# EAGLE design 6P1_EVB (EAGLE 7.5.0)
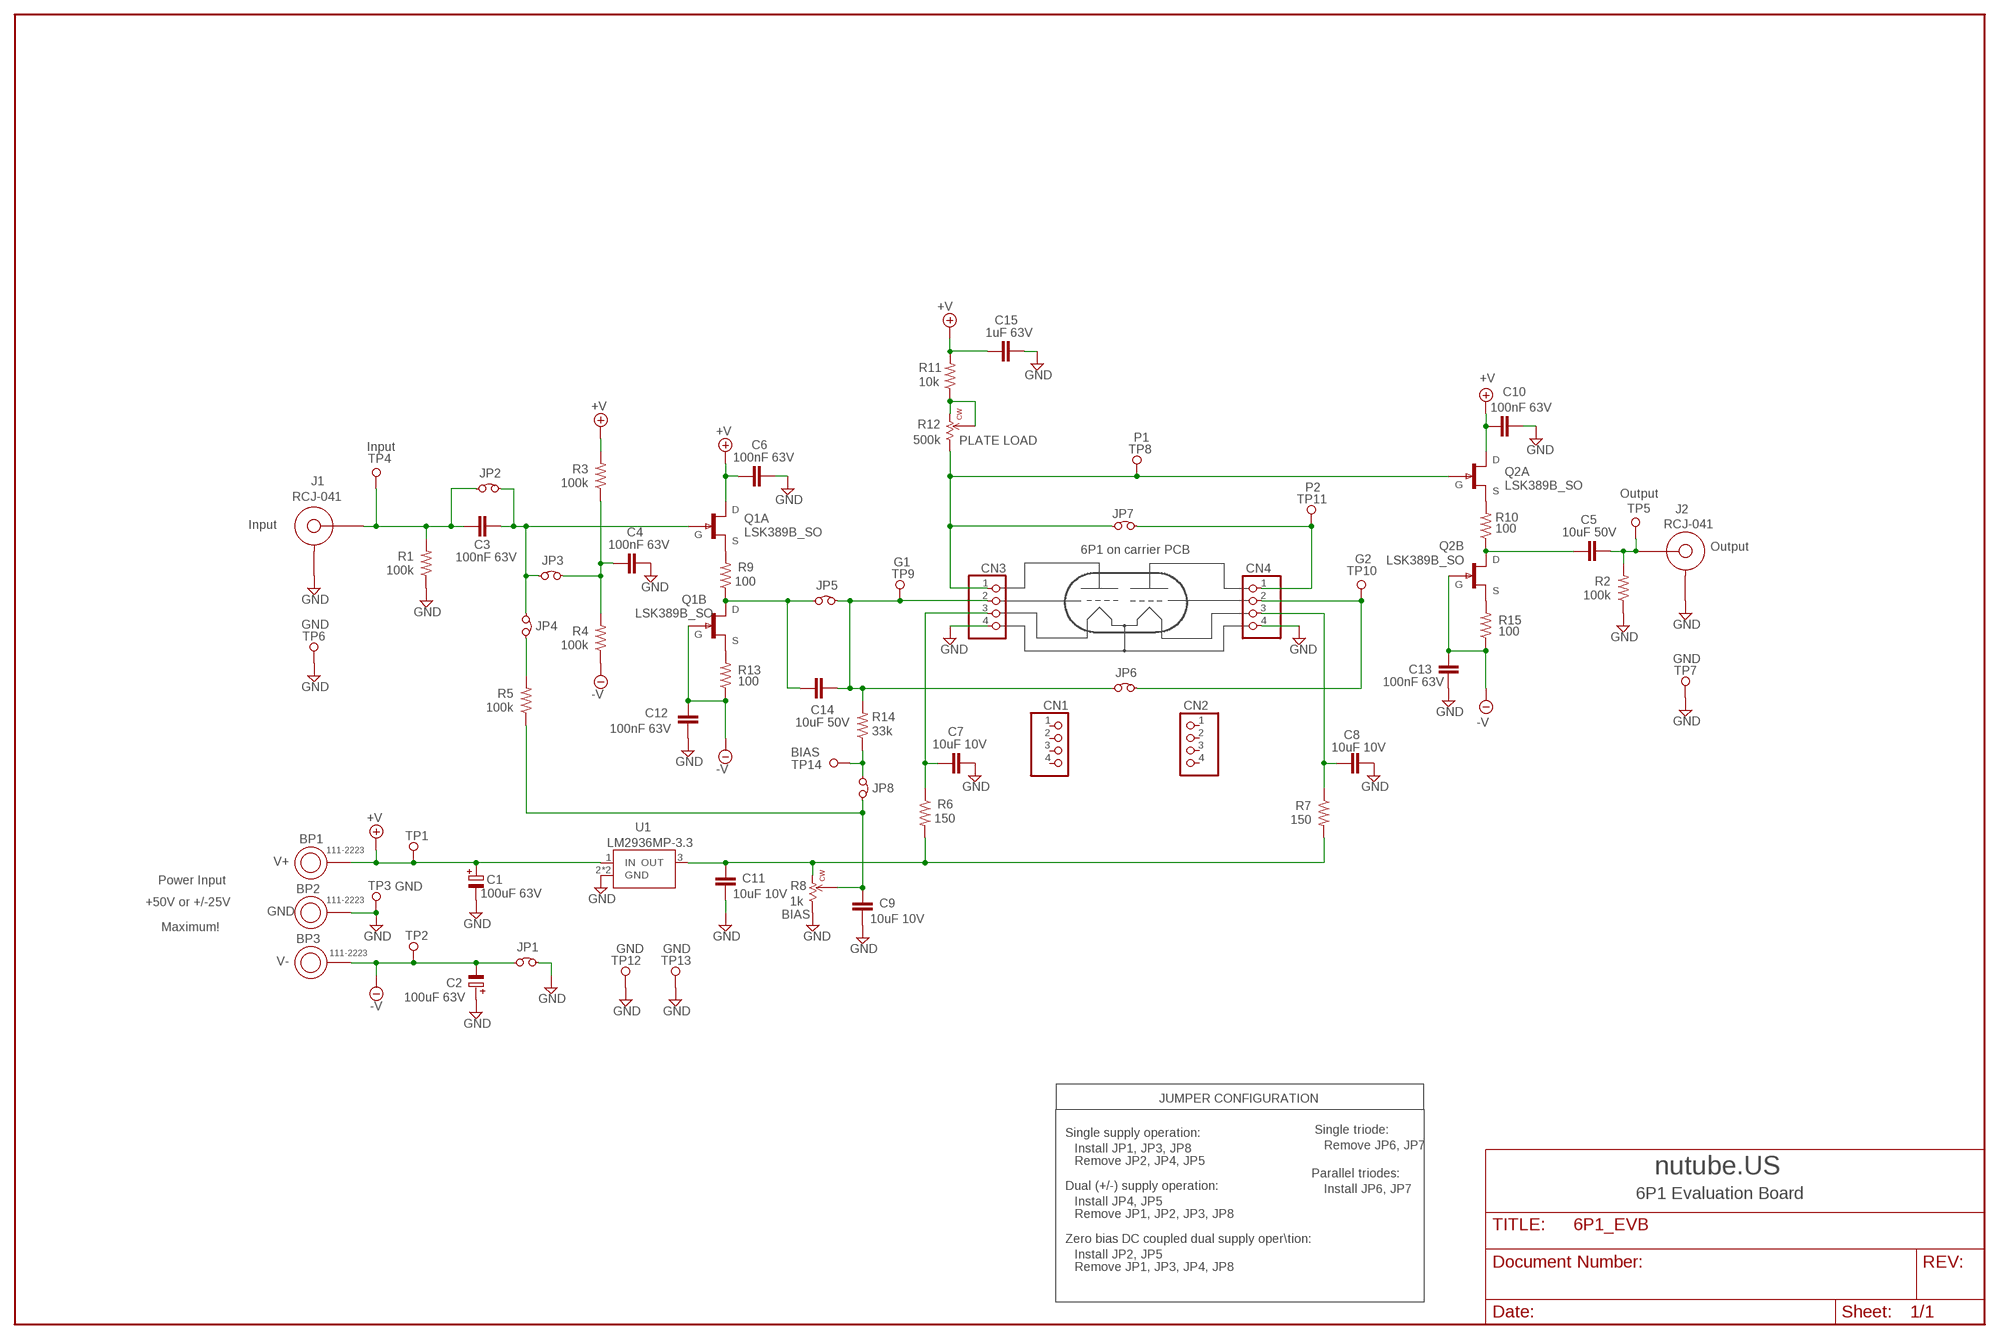
[diagram p0: schematic, sheet 1]

## Parts
BP1  111-2223  BANANA_BP  [BANANA_BP]
BP2  111-2223  BANANA_BP  [BANANA_BP]
BP3  111-2223  BANANA_BP  [BANANA_BP]
C1  100uF 63V  CAP_EL_SMT_10MM  [ELCAP_SMT_10MM]
C2  100uF 63V  CAP_EL_SMT_10MM  [ELCAP_SMT_10MM]
C3  100nF 63V  C-EU050-030X075  [C050-030X075]
C4  100nF 63V  C-EU050-030X075  [C050-030X075]
C5  10uF 50V  C-EU050-110X075  [C050-110X075]
C6  100nF 63V  C-EU050-030X075  [C050-030X075]
C7  10uF 10V  C-EUC1206  [C1206]
C8  10uF 10V  C-EUC1206  [C1206]
C9  10uF 10V  C-EUC1206  [C1206]
C10  100nF 63V  C-EU050-030X075  [C050-030X075]
C11  10uF 10V  C-EUC1206  [C1206]
C12  100nF 63V  C-EU050-030X075  [C050-030X075]
C13  100nF 63V  C-EU050-030X075  [C050-030X075]
C14  10uF 50V  C-EU050-110X075  [C050-110X075]
C15  1uF 63V  C-EU050-050X075  [C050-050X075]
CN1  PINHD-1X4  [1X04]
CN2  PINHD-1X4  [1X04]
CN3  PINHD-1X4  [1X04]
CN4  PINHD-1X4  [1X04]
J1  RCJ-041  JACK_RCA  [JACK_RCA]
J2  RCJ-041  JACK_RCA  [JACK_RCA]
JP1  JUMPER  [HDR2X1]
JP2  JUMPER  [HDR2X1]
JP3  JUMPER  [HDR2X1]
JP4  JUMPER  [HDR2X1]
JP5  JUMPER  [HDR2X1]
JP6  JUMPER  [HDR2X1]
JP7  JUMPER  [HDR2X1]
JP8  JUMPER  [HDR2X1]
Q1  LSK389B_SO  [SO8]
Q2  LSK389B_SO  [SO8]
R1  100k  R-US_R0805  [R0805]
R2  100k  R-US_R0805  [R0805]
R3  100k  R-US_R0805  [R0805]
R4  100k  R-US_R0805  [R0805]
R5  100k  R-US_R0805  [R0805]
R6  150  R-US_R0805  [R0805]
R7  150  R-US_R0805  [R0805]
R8  1k  TRIMPOT_3266  [TRIMPOT_3266]
R9  100  R-US_R0805  [R0805]
R10  100  R-US_R0805  [R0805]
R11  10k  R-US_R0805  [R0805]
R12  500k  TRIMPOT_3266  [TRIMPOT_3266]
R13  100  R-US_R0805  [R0805]
R14  33k  R-US_R0805  [R0805]
R15  100  R-US_R0805  [R0805]
TP1  TESTPOINT  [TESTPOINT_63]
TP2  TESTPOINT  [TESTPOINT_63]
TP3  TESTPOINT  [TESTPOINT_63]
TP4  TESTPOINT  [TESTPOINT_63]
TP5  TESTPOINT  [TESTPOINT_63]
TP6  TESTPOINT  [TESTPOINT_63]
TP7  TESTPOINT  [TESTPOINT_63]
TP8  TESTPOINT  [TESTPOINT_63]
TP9  TESTPOINT  [TESTPOINT_63]
TP10  TESTPOINT  [TESTPOINT_63]
TP11  TESTPOINT  [TESTPOINT_63]
TP12  TESTPOINT  [TESTPOINT_63]
TP13  TESTPOINT  [TESTPOINT_63]
TP14  TESTPOINT  [TESTPOINT_63]
U1  LM2936MP-3.3  LM2940S2  [SOT223-3]

## Nets
+V: BP1.P$2 C1.P$1(+) C6.2 C10.2 C15.2 Q1.2(A:D) Q2.2(A:D) R3.2 R11.2 TP1.P$1 U1.1(IN)
-V: BP3.P$2 C2.P$2(-) C12.2 C13.2 JP1.1 Q1.8(B:G) Q2.8(B:G) R4.1 R13.1 R15.1 TP2.P$1
G1: C14.1 CN3.2 JP5.2 JP6.1 R14.2 TP9.P$1
G2: CN4.2 JP6.2 TP10.P$1
GND: BP2.P$2 C1.P$2(-) C2.P$1(+) C4.1 C6.1 C7.2 C8.2 C9.2 C10.1 C11.2 C12.1 C13.1 C15.1 CN3.4 CN4.4 J1.P$1 J2.P$1 JP1.2 R1.1 R2.1 R8.1 TP3.P$1 TP6.P$1 TP7.P$1 TP12.P$1 TP13.P$1 U1.2(GND) U1.4(GND)
INL: C3.1 JP2.2 JP3.1 JP4.1 Q1.4(A:G)
N$1: Q1.1(A:S) R9.2
N$2: C14.2 JP5.1 Q1.6(B:D) R9.1
N$3: R11.1 R12.2 R12.3
N$4: C7.1 CN3.3 R6.1
N$5: C3.2 J1.P$2 JP2.1 R1.2 TP4.P$1
N$6: JP4.2 R5.2
N$7: Q2.5(B:S) R15.2
N$8: Q2.1(A:S) R10.2
N$9: C5.2 Q2.6(B:D) R10.1
N$10: C5.1 J2.P$2 R2.2 TP5.P$1
N$11: Q1.5(B:S) R13.2
N$12: C8.1 CN4.3 R7.1
N$13: C4.2 JP3.2 R3.1 R4.2
N$14: C9.1 JP8.2 R5.1 R8.2
N$15: JP8.1 R14.1 TP14.P$1
N$24: CN3.1 JP7.1 Q2.4(A:G) R12.1 TP8.P$1
PLATEL: CN4.1 JP7.2 TP11.P$1
V33: C11.1 R6.2 R7.2 R8.3 U1.3(OUT)
Unconnected: CN1.1 CN1.2 CN1.3 CN1.4 CN2.1 CN2.2 CN2.3 CN2.4

## Notes on the sheet
- PLATE LOAD | P1
- Input
- P2
- Output
- Input
- 6P1 on carrier PCB | Output
- G1 | G2
- GND
- GND
- BIAS
- V+
- Power Input
- GND
- +50V or +/-25V
- GND | BIAS
- Maximum!
- GND | GND
- V-
- JUMPER CONFIGURATION
- Single supply operation: | Single triode:
- Install JP1, JP3, JP8 | Remove JP6, JP7
- Remove JP2, JP4, JP5
- Parallel triodes: | nutube.US
- Dual (+/-) supply operation: | Install JP6, JP7
- 6P1 Evaluation Board
- Install JP4, JP5
- Remove JP1, JP2, JP3, JP8
- Zero bias DC coupled dual supply oper\tion:
- Install JP2, JP5
- Remove JP1, JP3, JP4, JP8

## Library data of the parts
BP1-BP3 = wheat:BANANA_BP: Banana jack / binding post Kobiconn 164-R105
C1 C2 = wheat:CAP_EL_SMT_10MM: CAP, ELECTRROLYTIC, 10MM DIA SMT
C3-C15 = rcl:C-EU: CAPACITOR, European symbol
CN1-CN4 = pinhead:PINHD-1X4: PIN HEADER
J1 J2 = wheat:JACK_RCA: SINGLE RCA JACK, CUI RCJ-04X
JP1-JP8 = wheat:JUMPER: Wire jumper .1" C
Q1 Q2 = wheat:LSK389B: dual nch jfet LSK389 TO71
R1-R7 R9-R11 R13-R15 = rcl:R-US_: RESISTOR, American symbol
R8 R12 = wheat:TRIMPOT_3266: TRIM POT, 1/4" BOURNS 3266
TP1-TP14 = wheat:TESTPOINT
U1 = wheat:LM2940S: REGULATOR, LM2940 SMD

## Net classes
2 lowcap: clearance 0.381 mm

## Board
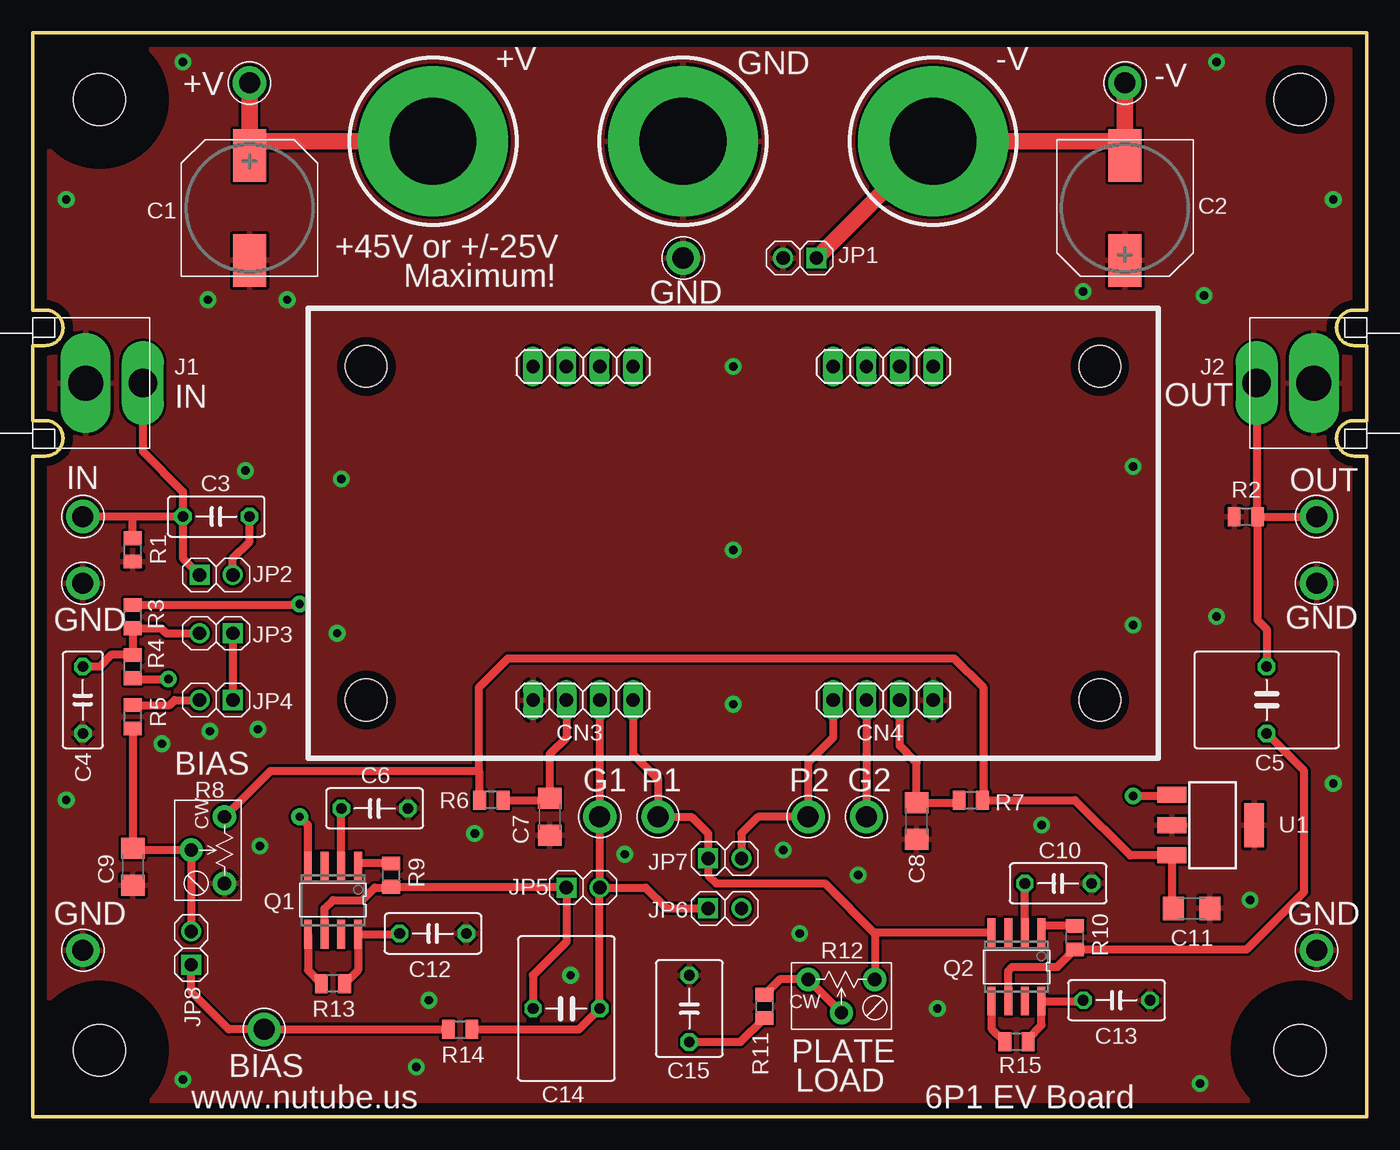
[diagram p1: board, top side]
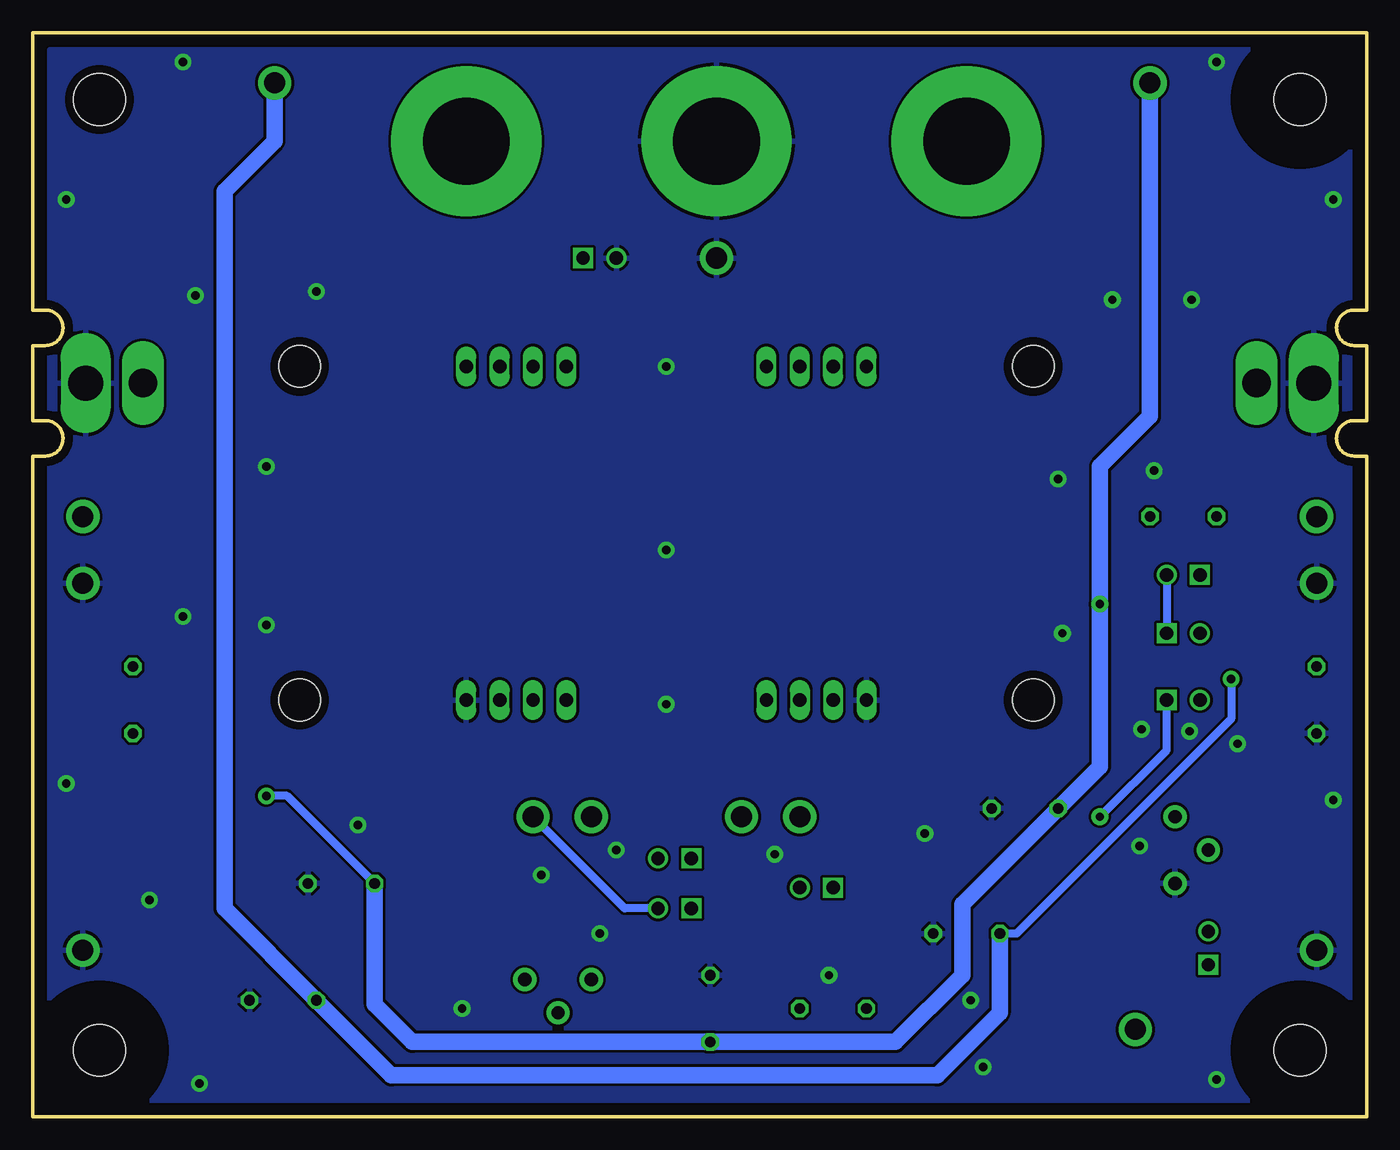
[diagram p2: board, bottom side, seen from below]

Size 101.6 x 82.55 mm. Coordinates in mm from the lower left corner, seen from the top.
Outline: 101.6,82.55 0,82.55 0,61.44 0.95,61.44 arc-180 0.95,58.74 0,58.74 0,53.02 0.95,53.02 arc-180 0.95,50.32 0,50.32 0,0 101.6,0 101.6,50.32 100.65,50.32 arc-180 100.65,53.02 101.6,53.02 101.6,58.74 100.65,58.74 arc-180 100.65,61.44 101.6,61.44 101.6,82.55
Copper layers (1*16): Top 0.035mm / dielectric 1.5mm / Bottom 0.035mm
Design rules "default *": minimum track width 7mil, minimum drill 10mil, track to track 8mil, track to pad 8mil, pad to pad 8mil, via to via 8mil, smd to smd 8mil, copper to edge 25mil, drill to drill 8mil, minimum pad ring 10mil, minimum via ring 8mil, stop-mask expansion 4mil, vias tented up to drill 12mil, thermal gap 10mil
Holes 3.17 mm at 25.4,31.75 25.4,57.15 81.28,57.15 81.28,31.75
Holes 3.96 mm at 5.08,77.47 96.52,77.47 96.52,5.08 5.08,5.08
tRestrict: area 0,72.4 to 10.2,82.5; area 91.4,0 to 101.6,10.2; area 0,0 to 10.2,10.2
bRestrict: area 0,0 to 10.2,10.2; area 91.4,0 to 101.6,10.2; area 0,72.4 to 10.2,82.5

### Footprints (pad centres in the part's own frame; a part is rotated, then mirrored left to right if it is on the bottom)
BANANA_BP = drill 6.604 pad 11.43: P$2 0,0
ELCAP_SMT_10MM = smd 2.5 x 4: P$1 0,4; P$2 0,-4
C050-030X075 = drill 0.813 octagon: 1 -2.54,0; 2 2.54,0
C050-110X075 = drill 0.813 octagon: 1 -2.54,0; 2 2.54,0
C1206 = smd 1.6 x 1.8: 1 -1.4,0; 2 1.4,0
C050-050X075 = drill 0.813 octagon: 1 -2.54,0; 2 2.54,0
1X04 = drill 1.016 long: 1 -3.81,0; 2 -1.27,0; 3 1.27,0; 4 3.81,0
JACK_RCA = drill 2.667 pad 3.81 long: P$1 0,-4.013 | drill 2.184 long: P$2 0,-8.382
HDR2X1 = drill 1.016 square: 1 0,0 | drill 1.016: 2 2.54,0
SO8 = smd 0.6 x 2.2: 1 -1.905,-2.6; 2 -0.635,-2.6; 3 0.635,-2.6; 4 1.905,-2.6; 5 1.905,2.6; 6 0.635,2.6; 7 -0.635,2.6; 8 -1.905,2.6
R0805 = smd 1.016 x 1.422: 1 -0.889,0; 2 0.889,0
TRIMPOT_3266 = drill 1.016 pad 1.778: 1 -2.54,-1.27; 2 0,1.27; 3 2.54,-1.27
TESTPOINT_63 = drill 1.6 pad 2.54: P$1 0,0
SOT223-3 = smd 1.219 x 2.235: 1 -2.311,-3.099; 2 0,-3.099; 3 2.311,-3.099 | smd 3.353 x 1.499: 4 0,3.175

### Placement (x,y rotation side)
BP1  30.48,74.3 0 top
BP2  49.53,74.3 0 top
BP3  68.58,74.3 0 top
C1  16.51,69.22 0 top
C2  83.19,69.22 180 top
C3  13.97,45.72 180 top
C4  3.81,31.75 90 top
C5  93.98,31.75 270 top
C6  26.04,23.49 180 top
C7  39.37,22.86 270 top
C8  67.31,22.54 270 top
C9  7.62,19.05 270 top
C10  78.11,17.78 180 top
C11  88.27,15.88 0 top
C12  30.48,13.97 180 top
C13  82.55,8.89 180 top
C14  40.64,8.25 180 top
C15  50.01,8.25 270 top
CN1  41.91,57.15 0 top
CN2  64.77,57.15 0 top
CN3  41.91,31.75 180 top
CN4  64.77,31.75 0 top
J1  0,55.88 90 top
J2  101.6,55.88 270 top
JP1  59.69,65.41 180 top
JP2  12.7,41.27 0 top
JP3  15.24,36.83 180 top
JP4  15.24,31.75 180 top
JP5  40.64,17.46 0 top
JP6  51.44,15.88 0 top
JP7  51.44,19.69 0 top
JP8  12.07,11.59 90 top
Q1  22.86,16.51 180 top
Q2  74.93,11.43 180 top
R1  7.62,43.18 90 top
R2  92.39,45.72 0 top
R3  7.62,38.1 90 top
R4  7.62,34.29 90 top
R5  7.62,30.48 90 top
R6  34.93,24.13 180 top
R7  71.44,24.13 0 top
R8  13.34,20.32 90 top
R9  27.31,18.41 90 top
R10  79.38,13.65 90 top
R11  55.72,8.41 270 top
R12  61.6,9.21 180 top
R13  22.86,10.16 180 top
R14  32.54,6.67 0 top
R15  74.93,5.71 180 top
TP1  16.51,78.74 0 top
TP2  83.19,78.74 0 top
TP3  49.53,65.41 0 top
TP4  3.81,45.72 0 top
TP5  97.79,45.72 0 top
TP6  3.81,40.64 0 top
TP7  97.79,40.64 0 top
TP8  47.62,22.86 0 top
TP9  43.18,22.86 0 top
TP10  63.5,22.86 0 top
TP11  59.06,22.86 0 top
TP12  3.81,12.7 0 top
TP13  97.79,12.7 0 top
TP14  17.62,6.67 0 top
U1  89.85,22.23 270 top

### Tracks (layer width: path | path; a pad name or v marks a point on that pad's centre or on a via)
+V  (via drill 0.64 pad 1.27)
  Top 0.61: R3.2 20.26,38.99 v20.32,39.05 | Q1.2 C6.2 | Q2.2 C10.2 | v83.82,24.45 86.67,24.45 U1.1 | C15.2 53.91,5.71 R11.2
  Top 1.27: 16.51,74.3 BP1.P$2 | C1.P$1 16.51,74.3 | 16.51,74.3 TP1.P$1
  Bottom 0.61: C10.2 82.23,24.45 v83.82,24.45
  Bottom 1.27: TP1.P$1 16.51,53.34 20.32,49.53 v20.32,39.05 20.32,26.67 C6.2 30.8,16.19 30.8,10.8 35.88,5.71 C15.2 72.71,5.71 75.56,8.57 C10.2
-V  (via drill 0.64 pad 1.27)
  Top 0.61: R13.1 24.77,11.18 Q1.8 27.88,13.91 C12.2 | C13.2 79.95,8.83 Q2.8 76.84,6.98 75.82,5.97 R15.1 | R4.1 7.53,33.4 7.46,33.34 v10.32,33.34
  Top 1.27: TP2.P$1 83.19,74.3 | 83.19,74.3 C2.P$2 | JP1.1 BP3.P$2 83.19,74.3
  Bottom 0.61: v10.32,33.34 10.32,30.32 26.67,13.97 C12.2
  Bottom 1.27: C12.2 27.94,7.94 32.7,3.18 74.3,3.18 C13.2 87,15.88 87,70.48 83.19,74.3 TP2.P$1
G1
  Top 0.61: R14.2 41.59,6.67 C14.1 JP5.2 | CN3.2 TP9.P$1 JP5.2 | JP5.2 46.67,17.46 48.26,15.88 JP6.1
G2
  Top 0.61: CN4.2 TP10.P$1
  Bottom 0.61: JP6.2 56.52,15.88 TP10.P$1
GND  (via drill 0.64 pad 1.27)
  other vias: 88.9,2.54 99.06,25.4 76.84,22.23 83.82,37.47 53.34,43.18 23.18,36.83 11.43,2.86 33.66,21.59 2.54,69.85 11.43,80.33 90.17,80.33 99.06,69.85 89.22,62.55 90.17,38.1 83.82,49.53 80.01,62.86 53.34,57.15 19.37,62.23 16.19,49.21 23.5,48.58 13.49,29.37 2.54,24.13 29.21,3.81 53.34,31.43 57.15,20.32 58.42,13.97 62.87,18.41 45.09,20 68.9,8.25 92.71,16.51 17.3,20.64 17.15,29.53 13.34,62.23 40.96,10.8 30.16,8.89 9.84,28.42
  pour Top: 1.27,81.28 100.33,81.28 100.33,1.27 1.27,1.27
  pour Bottom: 1.27,81.28 1.27,1.27 100.33,1.27 100.33,81.28
INL  (via drill 0.64 pad 1.27)
  Top 0.61: JP2.2 15.24,42.55 16.51,43.81 C3.1 | JP3.1 JP4.1 | Q1.4 20.96,22.23 v20.32,22.86
  Bottom 0.61: JP2.2 JP3.1 | v20.32,22.86 15.24,27.94 JP4.1
N$1
  Top 0.61: Q1.1 24.77,19.37 27.24,19.37 R9.2
N$2
  Top 0.61: Q1.6 22.23,15.88 22.86,16.51 25.08,16.51 26.04,17.46 27.24,17.46 R9.1 40.26,17.53 JP5.1 40.64,13.34 38.1,10.8 C14.2
N$3
  Top 0.61: R12.2 R12.3 56.9,10.48 R11.1
N$4
  Top 0.61: CN3.3 40.64,28.89 39.37,27.62 C7.1 39.24,24.13 R6.1
N$5
  Top 0.61: J1.P$2 8.38,50.67 11.43,47.62 C3.2 | C3.2 11.43,42.55 JP2.1 | C3.2 7.62,45.72 | R1.2 7.62,45.72 | 7.62,45.72 TP4.P$1
N$6
  Top 0.61: R5.2 10.41,31.37 10.8,31.75 JP4.2
N$7
  Top 0.61: Q2.5 73.03,6.73 R15.2
N$8
  Top 0.61: Q2.1 76.84,14.61 79.12,14.61 R10.2
N$9
  Top 0.61: Q2.6 74.3,11.11 74.61,11.43 78.04,11.43 R10.1 92.46,12.76 96.84,17.14 96.84,26.35 C5.2
N$10
  Top 0.61: J2.P$2 93.22,45.78 R2.2 | R2.2 TP5.P$1 | R2.2 93.28,37.85 93.98,37.15 C5.1
N$11
  Top 0.61: Q1.5 20.96,11.18 R13.2
N$12
  Top 0.61: R7.1 70.36,23.94 C8.1 67.31,26.99 66.04,28.26 CN4.3
N$13
  Top 0.61: C4.2 5.08,34.29 5.97,35.18 R4.2 R3.1 9.78,37.21 10.16,36.83 JP3.2
N$14
  Top 0.61: JP8.2 R8.2 7.75,20.32 C9.1 R5.1
N$15
  Top 0.61: R14.1 TP14.P$1 14.92,6.67 12.07,9.52 JP8.1
N$24
  Top 0.61: CN3.1 45.72,27.62 47.62,25.72 TP8.P$1 50.17,22.86 51.44,21.59 JP7.1 51.44,18.41 52.07,17.78 60.33,17.78 64.14,13.97 | Q2.4 64.2,14.03 64.14,13.97 | 64.14,13.97 R12.1
PLATEL
  Top 0.61: CN4.1 60.96,28.89 59.06,26.99 TP11.P$1 55.25,22.86 53.98,21.59 JP7.2
V33
  Top 0.61: C11.1 86.75,15.99 U1.3 83.59,19.91 79.38,24.13 R7.2 72.39,24.19 72.39,32.7 70.17,34.92 36.2,34.92 33.97,32.7 33.97,26.35 | R8.3 18.1,26.35 33.97,26.35 | 33.97,26.35 33.97,24.45 | 33.97,24.45 33.97,24.19 R6.2 34.04,24.38 33.97,24.45

### Text on the board
tPlace: +V | GND | -V | -V | +V | +45V or +/-25V | Maximum! | GND | OUT | IN | IN | OUT | GND | GND | BIAS | G1 | P1 | P2 | G2 | GND | GND | PLATE | BIAS | LOAD | www.nutube.us | 6P1 EV Board
tValues: TP1 | TP2 | TP3 | CN1 | CN2 | TP5 | TP4 | TP6 | TP7 | TP11 | TP8 | TP9 | TP10 | TP13 | TP12 | TP14